# Altium schematic sheet main.SchDoc
size A3
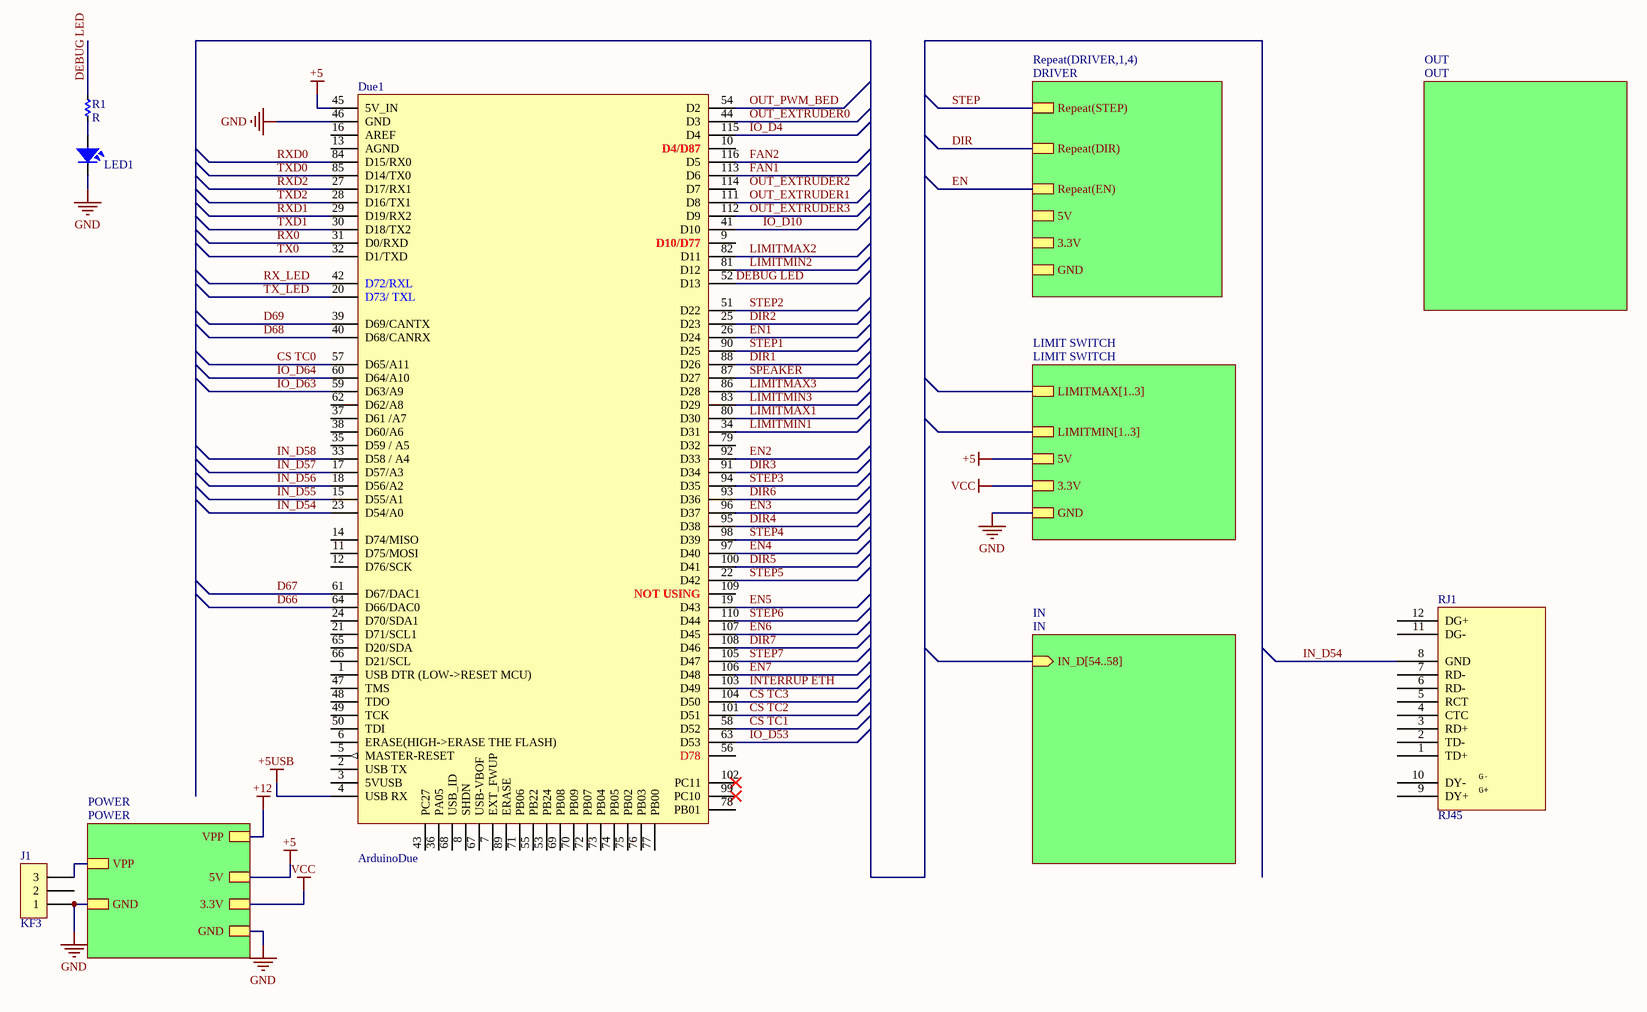
[diagram p0: main.SchDoc]

## Parts
Due1  ArduinoDue  [DUE_MODULE]
J1  KF3  [KF3-5.08T]
LED1  LED  [LED-0805-Blue]  (value not drawn)
R1  R  [RES-SMD-0603_BIG]
RJ1  RJ45  [RJ45-Dung]

## Sub-sheets
IN = IN: IN_D[54..58] (in)
LIMIT SWITCH = LIMIT SWITCH: LIMITMAX[1..3], LIMITMIN[1..3], 3.3V, GND, 5V
OUT = OUT: no entries
POWER = POWER: VPP, GND, 5V, GND, VPP, 3.3V
Repeat(DRIVER,1,4) = DRIVER: Repeat(STEP), Repeat(DIR), Repeat(EN), GND, 5V, 3.3V

## Nets
+5: Due1.45(5V_IN) ; sheet POWER/5V, sheet LIMIT SWITCH/5V
+5USB: Due1.4(USB_RX)
+12: sheet POWER/VPP
GND: Due1.46(GND) J1.1 LED1.2 ; sheet POWER/GND, sheet POWER/GND, sheet LIMIT SWITCH/GND
VCC: sheet POWER/3.3V, sheet LIMIT SWITCH/3.3V
CS TC0: Due1.57(D65/A11)
CS TC1: Due1.58(D52)
CS TC2: Due1.101(D51)
CS TC3: Due1.104(D50)
D66: Due1.64(D66/DAC0)
D67: Due1.61(D67/DAC1)
D68: Due1.40(D68/CANRX)
D69: Due1.39(D69/CANTX)
DEBUG LED: Due1.52(D13) R1.1
DIR: sheet Repeat(DRIVER,1,4)/Repeat(DIR)
DIR1: Due1.88(D26)
DIR2: Due1.25(D23)
DIR3: Due1.91(D34)
DIR4: Due1.95(D38)
DIR5: Due1.100(D41)
DIR6: Due1.93(D36)
DIR7: Due1.108(D46)
EN: sheet Repeat(DRIVER,1,4)/Repeat(EN)
EN1: Due1.26(D24)
EN2: Due1.92(D33)
EN3: Due1.96(D37)
EN4: Due1.97(D40)
EN5: Due1.19(D43)
EN6: Due1.107(D45)
EN7: Due1.106(D48)
FAN1: Due1.113(D6)
FAN2: Due1.116(D5)
IN_D54: Due1.23(D54/A0) RJ1.8(GND)
IN_D55: Due1.15(D55/A1)
IN_D56: Due1.18(D56/A2)
IN_D57: Due1.17(D57/A3)
IN_D58: Due1.33(D58_/_A4)
INTERRUP ETH: Due1.103(D49)
IO_D4: Due1.115(D4)
IO_D10: Due1.41(D10)
IO_D53: Due1.63(D53)
IO_D63: Due1.59(D63/A9)
IO_D64: Due1.60(D64/A10)
LIMITMAX1: Due1.80(D30)
LIMITMAX2: Due1.82(D11)
LIMITMAX3: Due1.86(D28)
LIMITMIN1: Due1.34(D31)
LIMITMIN2: Due1.81(D12)
LIMITMIN3: Due1.83(D29)
OUT_EXTRUDER0: Due1.44(D3)
OUT_EXTRUDER1: Due1.111(D8)
OUT_EXTRUDER3: Due1.112(D9)
OUT_PWM_BED: Due1.54(D2)
RX0: Due1.31(D0/RXD)
RX_LED: Due1.42(D72/RXL)
RXD0: Due1.84(D15/RX0)
RXD1: Due1.29(D19/RX2)
RXD2: Due1.27(D17/RX1)
SPEAKER: Due1.87(D27)
STEP: sheet Repeat(DRIVER,1,4)/Repeat(STEP)
STEP1: Due1.90(D25)
STEP2: Due1.51(D22)
STEP3: Due1.94(D35)
STEP4: Due1.98(D39)
STEP5: Due1.22(D42)
STEP6: Due1.110(D44)
STEP7: Due1.105(D47)
TX0: Due1.32(D1/TXD)
TX_LED: Due1.20(D73/_TXL)
TXD0: Due1.85(D14/TX0)
TXD1: Due1.30(D18/TX2)
TXD2: Due1.28(D16/TX1)
NetJ1_3: J1.3 ; sheet POWER/VPP
NetLED1_1: LED1.1 R1.2

Not connected (* = marked no-connect by the designer): Due1 1(USB_DTR_(LOW->RESET_MCU)) 2(USB_TX) 3(5VUSB) 5(MASTER-RESET) 6(ERASE(HIGH->ERASE_THE_FLASH)) 7(EXT_FWUP) 8(SHDN) 9(D10/D77) 10(D4/D87) 11(D75/MOSI) 12(D76/SCK_) 13(AGND) 14(D74/MISO) 16(AREF) 21(D71/SCL1) 24(D70/SDA1) 35(D59_/_A5) 36(PA05) 37(D61_/A7_) 38(D60/A6) 43(PC27) 47(TMS) 48(TDO) 49(TCK) 50(TDI) 53(PB24) 55(PB22) 56(D78) 62(D62/A8) 65(D20/SDA) 66(D21/SCL) 67(USB-VBOF) 68(USB_ID) 69(PB08) 70(PB09) 71(PB06) 72(PB07) 73(PB04) 74(PB05) 75(PB02) 76(PB03) 77(PB00) 78(PB01) 79(D32) 89(ERASE) 99(PC10)* 102(PC11)* 109(NOT_USING) 114(D7); J1 2; RJ1 1(TD+) 2(TD-) 3(RD+) 4(CTC) 5(RCT) 6(RD-) 7(RD-) 9(DY+) 10(DY-) 11(DG-) 12(DG+)

## Buses and harness runs
bus sheet IN/IN_D[54..58] = sheet LIMIT SWITCH/LIMITMAX[1..3] = sheet LIMIT SWITCH/LIMITMIN[1..3]

## Notes on the sheet
- Labels drawn without touching a wire or pin: OUT_EXTRUDER2
- (in symbol CON JR45) G-; G+

## Library data of the parts
J1 = KF3: Manufacturer: Würth Elektronik eiSos GmbH; partNo: 691103110003; ComponentLink1 Description: Manufacturer; ComponentLink2 Description: Datasheet; NoPins: 3; Created Date: 29 October 2013; ComponentLink1URL: http://www.we-online.com; ComponentLink2URL: http://katalog.we-online.de/em/datasheet/6911031100xx.pdf; Created by: Karrer Zheng
LED1 = LED SMD: Value: LED 3 - 5 ly 2 Colour
RJ1 = CON JR45: ComponentLink1Description: Mua; ComponentLink1URL: https://thegioiic.com/products/rj45-top-cong-rj45-top-180-do
Due1 = ArduinoDue: ComponentLink1Description: Buy; ComponentLink1URL: http://www.inhaos.com/product_info.php?products_id=164